# Altium schematic sheet temp sense 2.0 top.SchDoc: 2026 Temp Sense blocks
size 863 x 558 mm; Date: 11/29/2025; Author: Mitchell Donahue; CompanyName: Lawrence Technological University; DrawnBy: Mitchell Donahue; Engineer: Mitchell Donahue; Organization: Blue Devil Motorsport; DocumentNumber: 1; Revision: 1; SheetNumber: 1; SheetTotal: 5; =Project: Temp sense; Application_BuildNumber: 1
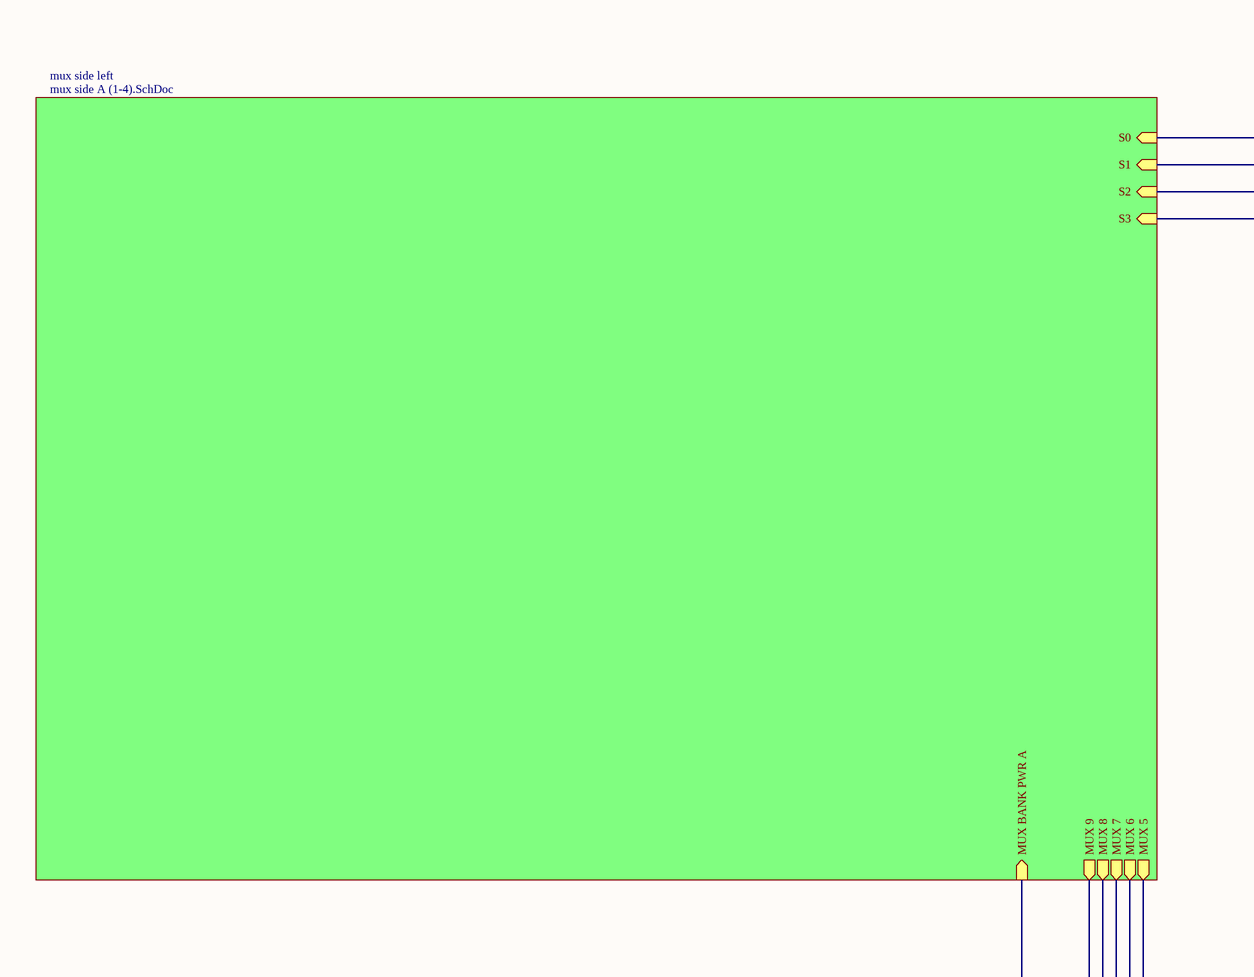
[diagram p0: temp sense 2.0 top.SchDoc, top left]
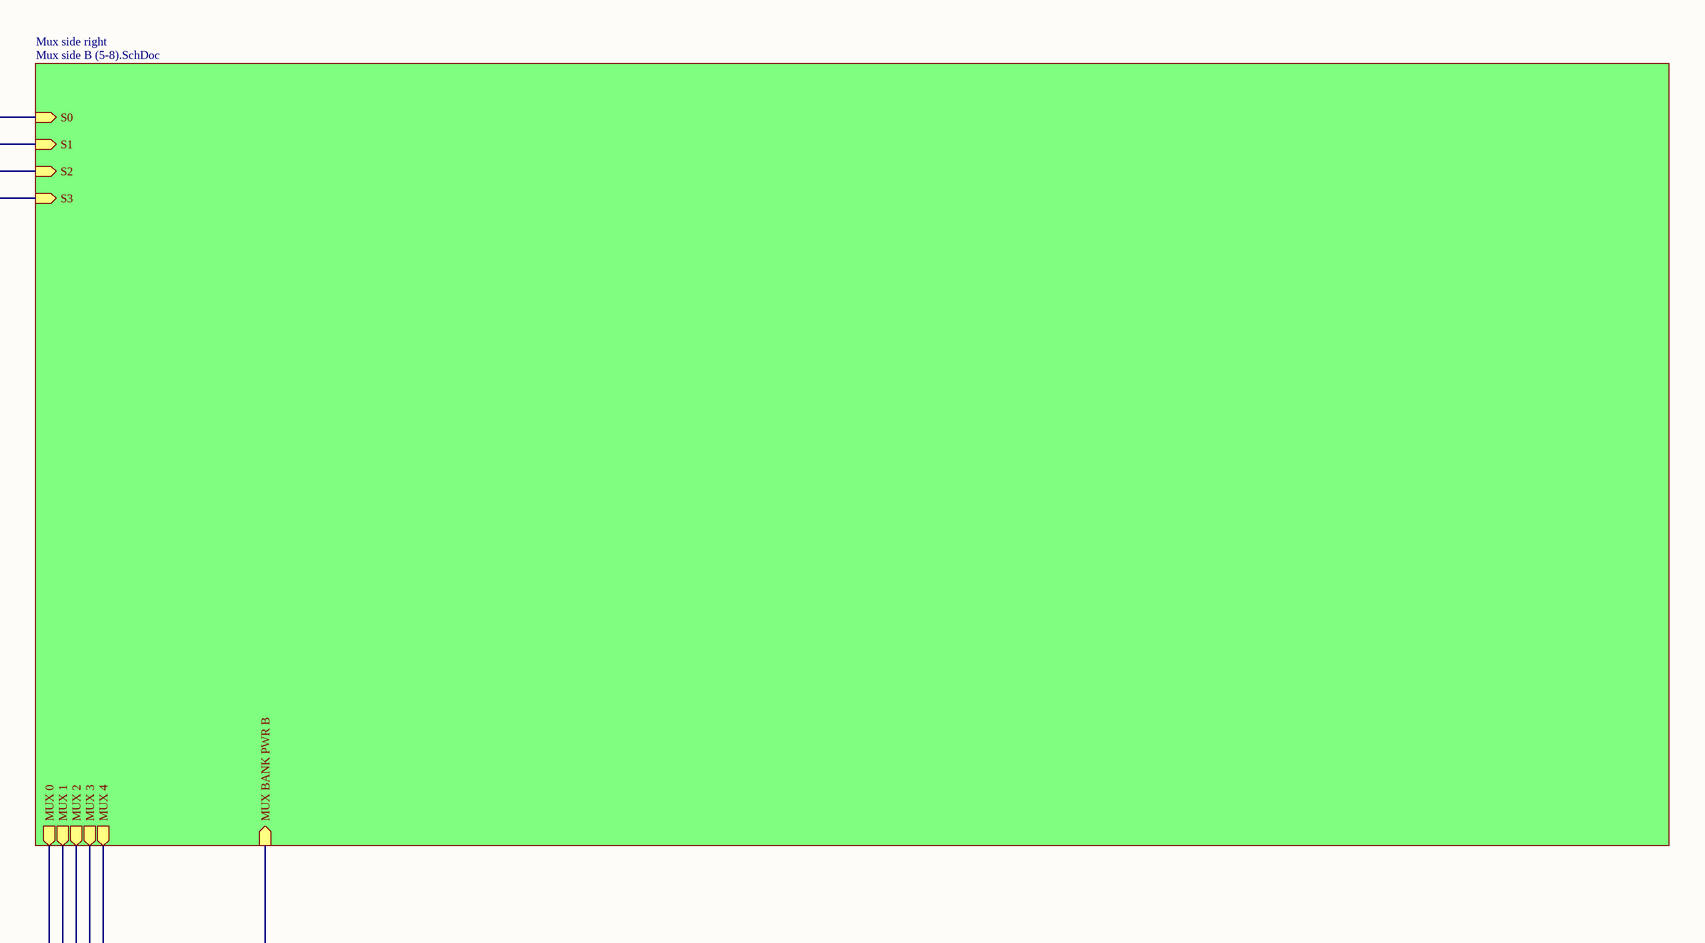
[diagram p1: temp sense 2.0 top.SchDoc, top right]
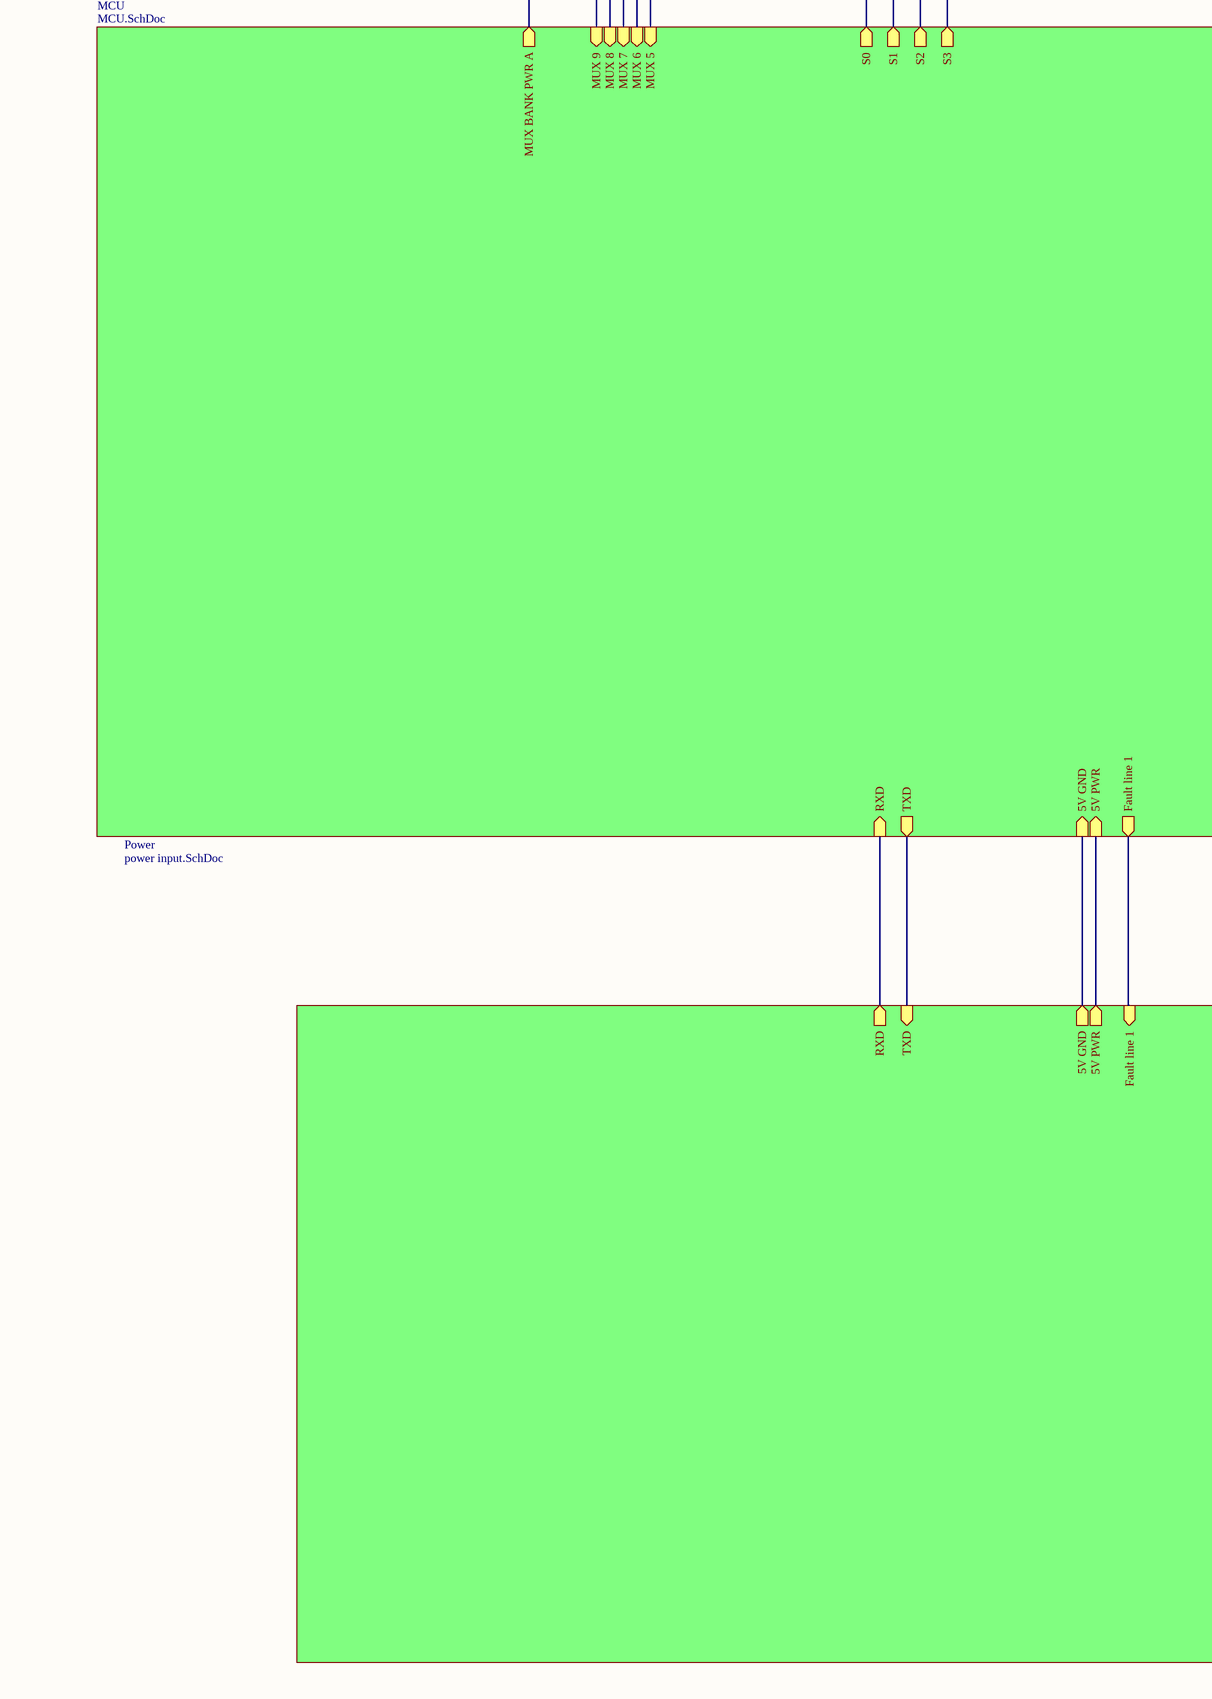
[diagram p2: temp sense 2.0 top.SchDoc, bottom left]
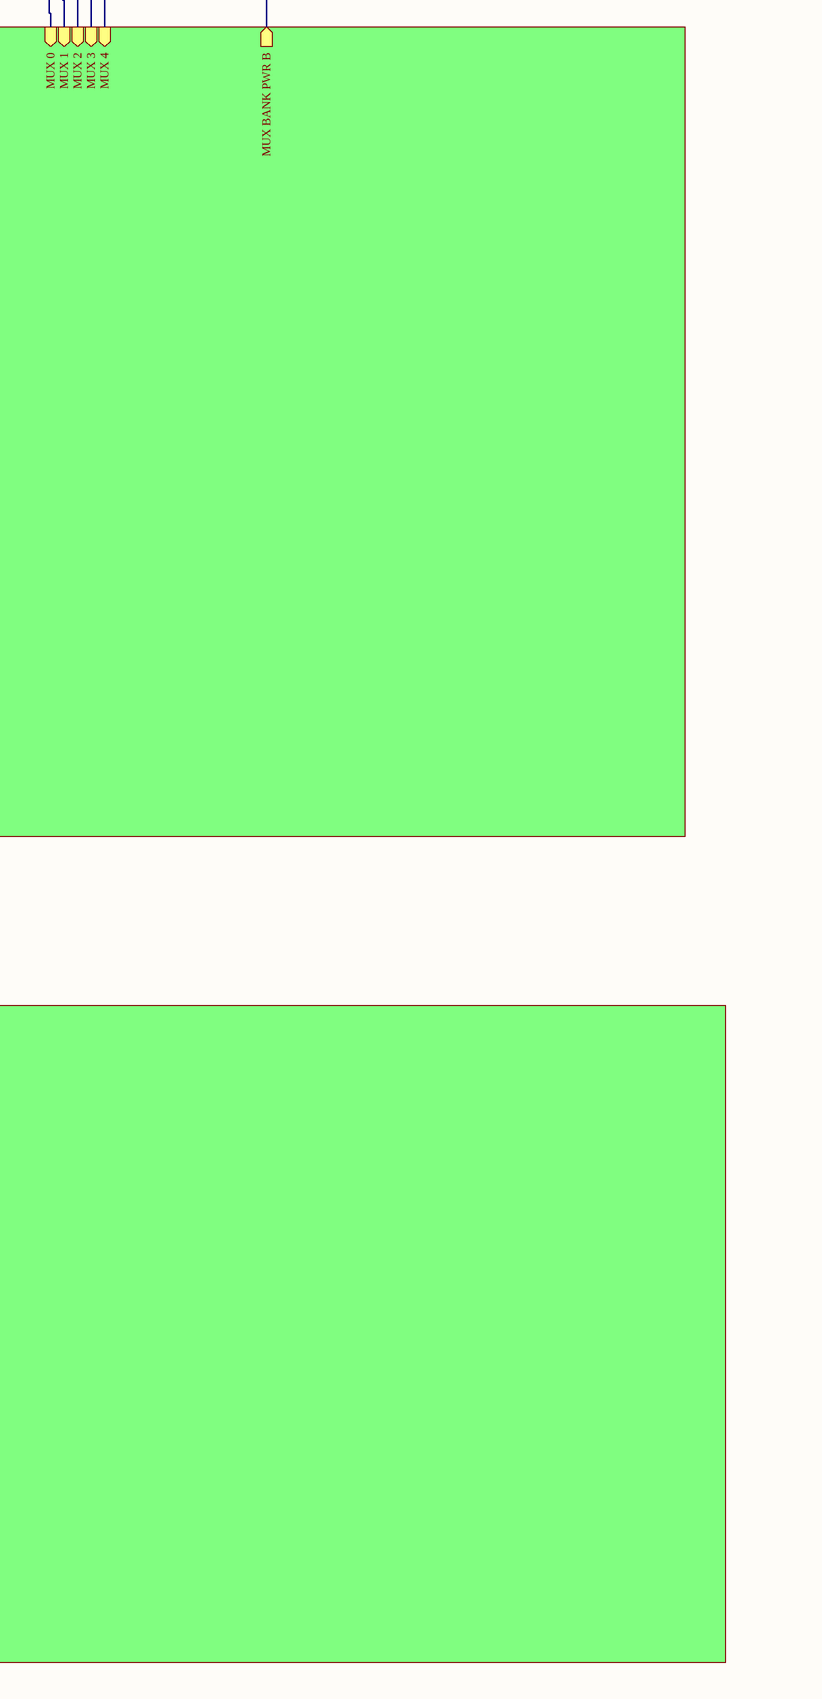
[diagram p3: temp sense 2.0 top.SchDoc, bottom right]

## Sub-sheets
MCU = MCU.SchDoc: S0 (out), S1 (out), S2 (out), S3 (out), MUX 0 (in), MUX 1 (in), MUX 2 (in), MUX 3 (in), MUX 4 (in), MUX 5 (in), MUX 6 (in), MUX 7 (in), MUX 8 (in), MUX 9 (in), 5V GND (in), 5V PWR (in), MUX BANK PWR A (out), MUX BANK PWR B (out), TXD (out), RXD (in), Fault line 1 (out)
mux side left = mux side A (1-4).SchDoc: S0 (in), S1 (in), S2 (in), S3 (in), MUX 5 (out), MUX 6 (out), MUX 7 (out), MUX 8 (out), MUX 9 (out), MUX BANK PWR A (in)
Mux side right = Mux side B (5-8).SchDoc: S0 (in), S1 (in), S2 (in), S3 (in), MUX 0 (out), MUX 1 (out), MUX 2 (out), MUX 3 (out), MUX 4 (out), MUX BANK PWR B (in)
Power = power input.SchDoc: 5V GND (out), 5V PWR (out), RXD (out), TXD (in), Fault line 1 (in)

## Nets
(unnamed): sheet Mux side right/S0, sheet mux side left/S0, sheet MCU/S0
(unnamed): sheet Mux side right/S1, sheet mux side left/S1, sheet MCU/S1
(unnamed): sheet Mux side right/S2, sheet mux side left/S2, sheet MCU/S2
(unnamed): sheet Mux side right/S3, sheet mux side left/S3, sheet MCU/S3
(unnamed): sheet Mux side right/MUX 0, sheet MCU/MUX 0
(unnamed): sheet Mux side right/MUX 1, sheet MCU/MUX 1
(unnamed): sheet Mux side right/MUX 2, sheet MCU/MUX 2
(unnamed): sheet Mux side right/MUX 3, sheet MCU/MUX 3
(unnamed): sheet Mux side right/MUX 4, sheet MCU/MUX 4
(unnamed): sheet Mux side right/MUX BANK PWR B, sheet MCU/MUX BANK PWR B
(unnamed): sheet mux side left/MUX 5, sheet MCU/MUX 5
(unnamed): sheet mux side left/MUX 6, sheet MCU/MUX 6
(unnamed): sheet mux side left/MUX 7, sheet MCU/MUX 7
(unnamed): sheet mux side left/MUX 8, sheet MCU/MUX 8
(unnamed): sheet mux side left/MUX 9, sheet MCU/MUX 9
(unnamed): sheet mux side left/MUX BANK PWR A, sheet MCU/MUX BANK PWR A
(unnamed): sheet Power/5V GND, sheet MCU/5V GND
(unnamed): sheet Power/5V PWR, sheet MCU/5V PWR
(unnamed): sheet Power/RXD, sheet MCU/RXD
(unnamed): sheet Power/TXD, sheet MCU/TXD
(unnamed): sheet Power/Fault line 1, sheet MCU/Fault line 1

## Notes on the sheet
- DWG. NO.
- REV.
- SHT.
- REVISION
- DESCRIPTION
- DATE
- APPROVED
- THIS DOCUMENT AND THE DATA DISCLOSED HEREIN OR HEREWITH IS THE PROPERTY OF ALTIUM LIMITED AND MAY BE FREELY DISTRIBUTED IN WHOLE. NO RIGHTS ARE RESERVED OR EXPRESS OR IMPLIED WARANTEE GIVEN.
- ENG:
- DSN:
- APPROVALS
- PROJECT
- DOCUMENT REVISION:
- DESIGN ITEM:
- CHK:
- BOM:
- REFERENCE DOCUMENTS
- PROJECT REVISION:
- TITLE
- FAB DWG:
- PCB DWG:
- ASSY DWG:
- SCALE:
- SIZE
- D
- CAGE CODE
- FILE NAME
- DWG NO.
- SHEET
- OF
- REV